# Altium schematic sheet Sensors.SchDoc
size A4; SheetNumber: 1; SheetTotal: 6
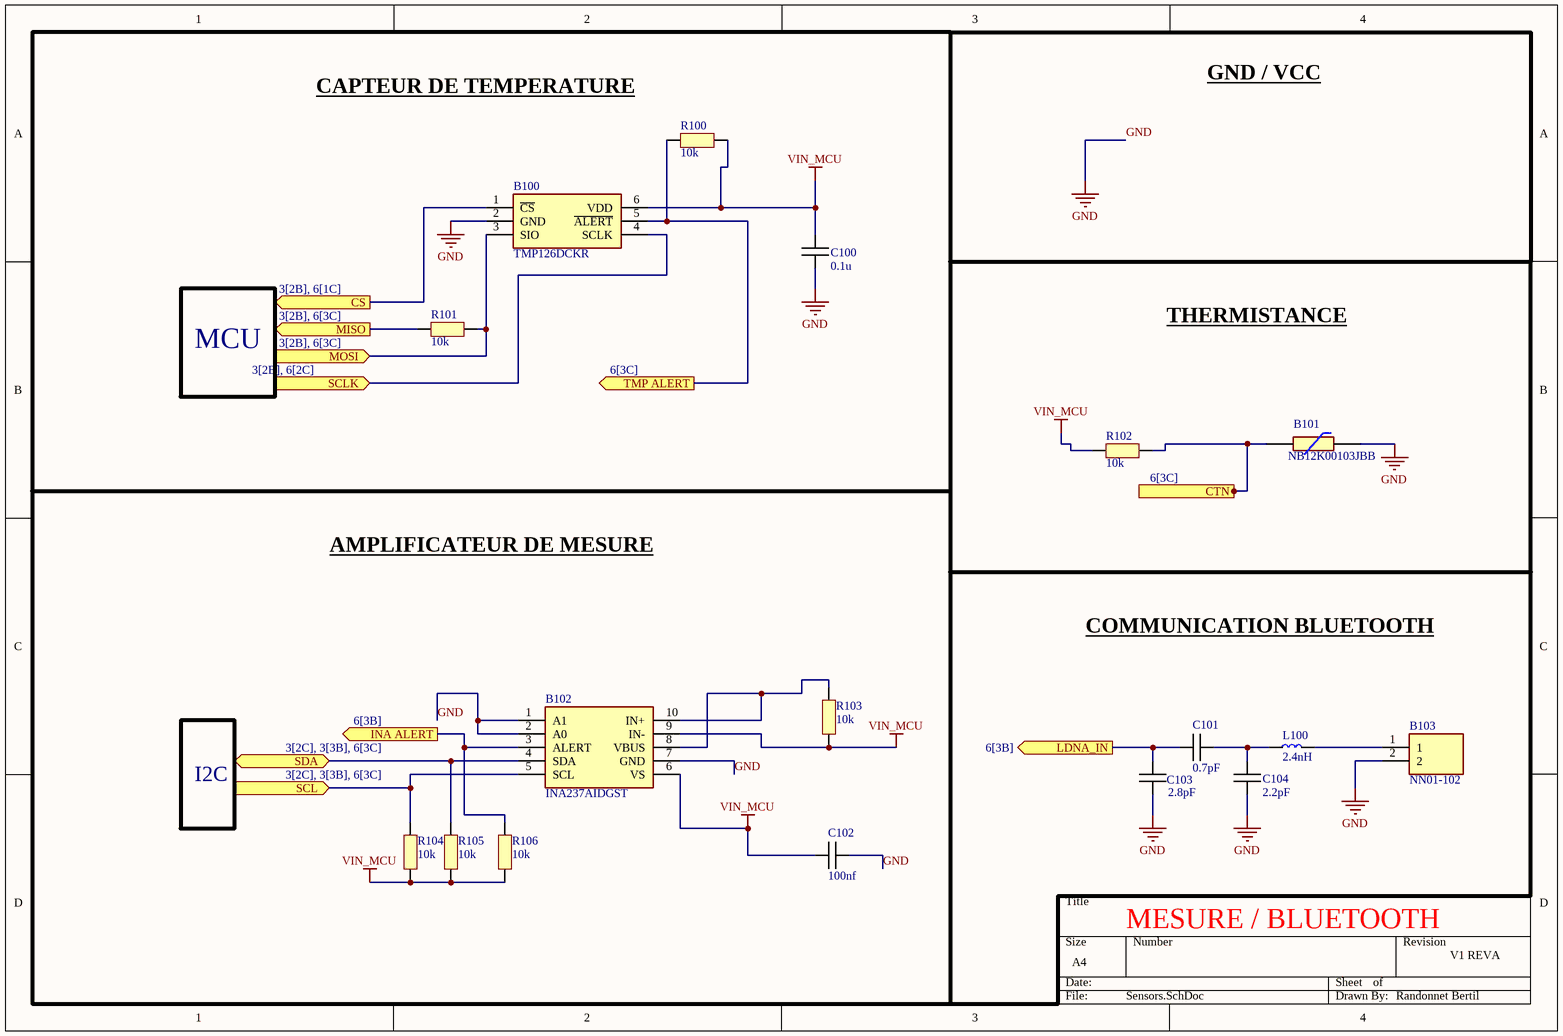
[diagram p0: Sensors.SchDoc]

## Parts
B100  TMP126DCKR  [SOT65P210X110-6N]
B101  NB12K00103JBB  [RESC2212X50N]
B102  INA237AIDGST  [SOP50P490X110-10N]
B103  NN01-102  [NN01-102]
C100  0.1u  [CAPC1005X06N]
C101  0.7pF  [CAPC1005X06N]
C102  100nf  [CAPC1005X06N]
C103  2.8pF  [CAPC1005X06N]
C104  2.2pF  [CAPC1005X06N]
L100  2.4nH  [LQPC1005X06N]
R100  10k  [RESC1005X06N]
R101  10k  [RESC1005X06N]
R102  10k  [RESC1005X06N]
R103  10k  [RESC1005X06N]
R104  10k  [RESC1005X06N]
R105  10k  [RESC1005X06N]
R106  10k  [RESC1005X06N]

## Ports
CS (out, see 3[2B], 6[1C]), CTN (out, see 6[3C]), INA ALERT (out, see 6[3B]), LDNA_IN (out, see 6[3B]), MISO (out, see 3[2B], 6[3C]), MOSI (in, see 3[2B], 6[3C]), SCL (in, see 3[2C], 3[3B], 6[3C]), SCLK (in, see 3[2B], 6[2C]), SDA (bidir, see 3[2C], 3[3B], 6[3C]), TMP ALERT (out, see 6[3C])

## Nets
GND: B100.2(GND) B101.1 B102.1(A1) B102.2(A0) B102.7(GND) B103.2 C100.2 C102.1 C103.2 C104.2
VIN_MCU: B100.6(VDD) B102.6(VS) B102.9(IN-) C100.1 C102.2 R100.2 R102.1 R103.1 R104.1 R105.1 R106.1
CS: B100.1(~{CS}) ; port CS
CTN: B101.2 R102.2 ; port CTN
INA ALERT: B102.3(ALERT) R106.2 ; port INA ALERT
LDNA_IN: C101.1 C103.1 ; port LDNA_IN
MISO: R101.1 ; port MISO
MOSI: B100.3(SIO) R101.2 ; port MOSI
SCL: B102.5(SCL) R104.2 ; port SCL
SCLK: B100.4(SCLK) ; port SCLK
SDA: B102.4(SDA) R105.2 ; port SDA
TMP ALERT: B100.5(~{ALERT}) R100.1 ; port TMP ALERT
NetB102_8: B102.8(VBUS) B102.10(IN+) R103.2
NetB103_1: B103.1 L100.2
NetC101_2: C101.2 C104.1 L100.1

## Notes on the sheet
- CAPTEUR DE TEMPERATURE <https://www.ti.com/lit/ds/symlink/tmp126.pdf?ts=1732713559769&ref_url=https%253A%252F%252Fwww.ti.com%252Fproduct%252FTMP126>
- GND / VCC
- MCU
- THERMISTANCE <https://www.mouser.fr/datasheet/2/40/nc12_20-3165165.pdf>
- AMPLIFICATEUR DE MESURE <https://www.ti.com/lit/ds/symlink/ina237.pdf?ts=1732718382153&ref_url=https%253A%252F%252Fwww.ti.com%252Famplifier-circuit%252Fcurrent-sense%252Fdigital-power-monitors%252Fproducts.html>
- COMMUNICATION BLUETOOTH <https://www.mouser.fr/datasheet/2/40/nc12_20-3165165.pdf>
- I2C
- MESURE / BLUETOOTH
- V1 REVA
- Randonnet Bertil

## Library data of the parts
B100 = TMP126DCKR: Board Mount Temperature Sensors +/-0.25 C SPI temperature sensor with 175 C operation, CRC and slew-rate alert; Manufacturer_Name: Texas Instruments; Manufacturer_Part_Number: TMP126DCKR; Mouser Part Number: 595-TMP126DCKR
B101 = NB12K00103JBB: NTC SMD Thermistor, NB12K, 10K, 5% AVX 10k 0805 Protection NTC Thermistor, 5s, 2 x 1.25 x 1.3mm; Manufacturer_Name: Kyocera AVX; Geometry.Height: 0.5mm; Manufacturer_Part_Number: NB12K00103JBB; Mouser Part Number: 581-NB12K00103JBB; Mouser Price/Stock: https://www.mouser.co.uk/ProductDetail/AVX/NB12K00103JBB/?qs=4%252B6%252BTdINQeDPvI%252BQUQjJ3Q%3D%3D; Arrow Part Number: NB12K00103JBB; Arrow Price/Stock: https://www.arrow.com/en/products/nb12k00103jbb/avx; Datasheet Link: https://datasheet.datasheetarchive.com/originals/distributors/Datasheets-DGA6/551314.pdf
B102 = INA237AIDGST: Current Sense Amplifiers 85-V, 16-bit, I2C output current/voltage/power monitor with alert 10-VSSOP -40 to 125; Manufacturer_Name: Texas Instruments; Manufacturer_Part_Number: INA237AIDGST; Mouser Part Number: 595-INA237AIDGST
B103 = NN01-102: Antennes Compact Reach Xtend 2.4 GHz
C100-C104 = Capacitor
L100 = Bobine
R100-R106 = Resistor